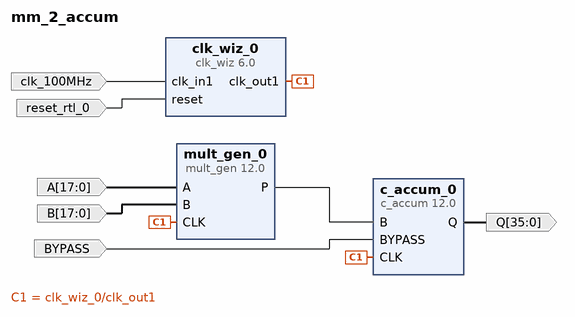
[diagram p0: block diagram of the top level]
# Vivado block design mm_2_accum, xc7a35tcpg236-2L, Vivado 2023.1
create_bd_design mm_2_accum

create_bd_port -dir I -from 17 -to 0 -type data A
create_bd_port -dir I -from 17 -to 0 -type data B
create_bd_port -dir I -type data BYPASS
create_bd_port -dir O -from 35 -to 0 -type data Q
create_bd_port -dir I -type clk clk_100MHz
set_property -dict {CONFIG.FREQ_HZ 100000000} [get_bd_ports clk_100MHz]
create_bd_port -dir I -type rst reset_rtl_0
set_property -dict {CONFIG.POLARITY ACTIVE_HIGH} [get_bd_ports reset_rtl_0]

create_bd_cell -type ip -vlnv xilinx.com:ip:c_accum:12.0 c_accum_0
create_bd_cell -type ip -vlnv xilinx.com:ip:mult_gen:12.0 mult_gen_0
create_bd_cell -type ip -vlnv xilinx.com:ip:clk_wiz:6.0 clk_wiz_0

# ---- connections ----

connect_bd_net [get_bd_ports A] [get_bd_pins mult_gen_0/A]
connect_bd_net [get_bd_ports BYPASS] [get_bd_pins c_accum_0/BYPASS]
connect_bd_net [get_bd_ports B] [get_bd_pins mult_gen_0/B]
connect_bd_net [get_bd_pins c_accum_0/Q] [get_bd_ports Q]
connect_bd_net [get_bd_ports clk_100MHz] [get_bd_pins clk_wiz_0/clk_in1]
connect_bd_net [get_bd_pins mult_gen_0/P] [get_bd_pins c_accum_0/B]
connect_bd_net -net reset_rtl_0_1 [get_bd_ports reset_rtl_0] [get_bd_pins clk_wiz_0/reset]
connect_bd_net -net sim_clk_gen_0_clk [get_bd_pins clk_wiz_0/clk_out1] [get_bd_pins mult_gen_0/CLK] [get_bd_pins c_accum_0/CLK]

validate_bd_design
save_bd_design
